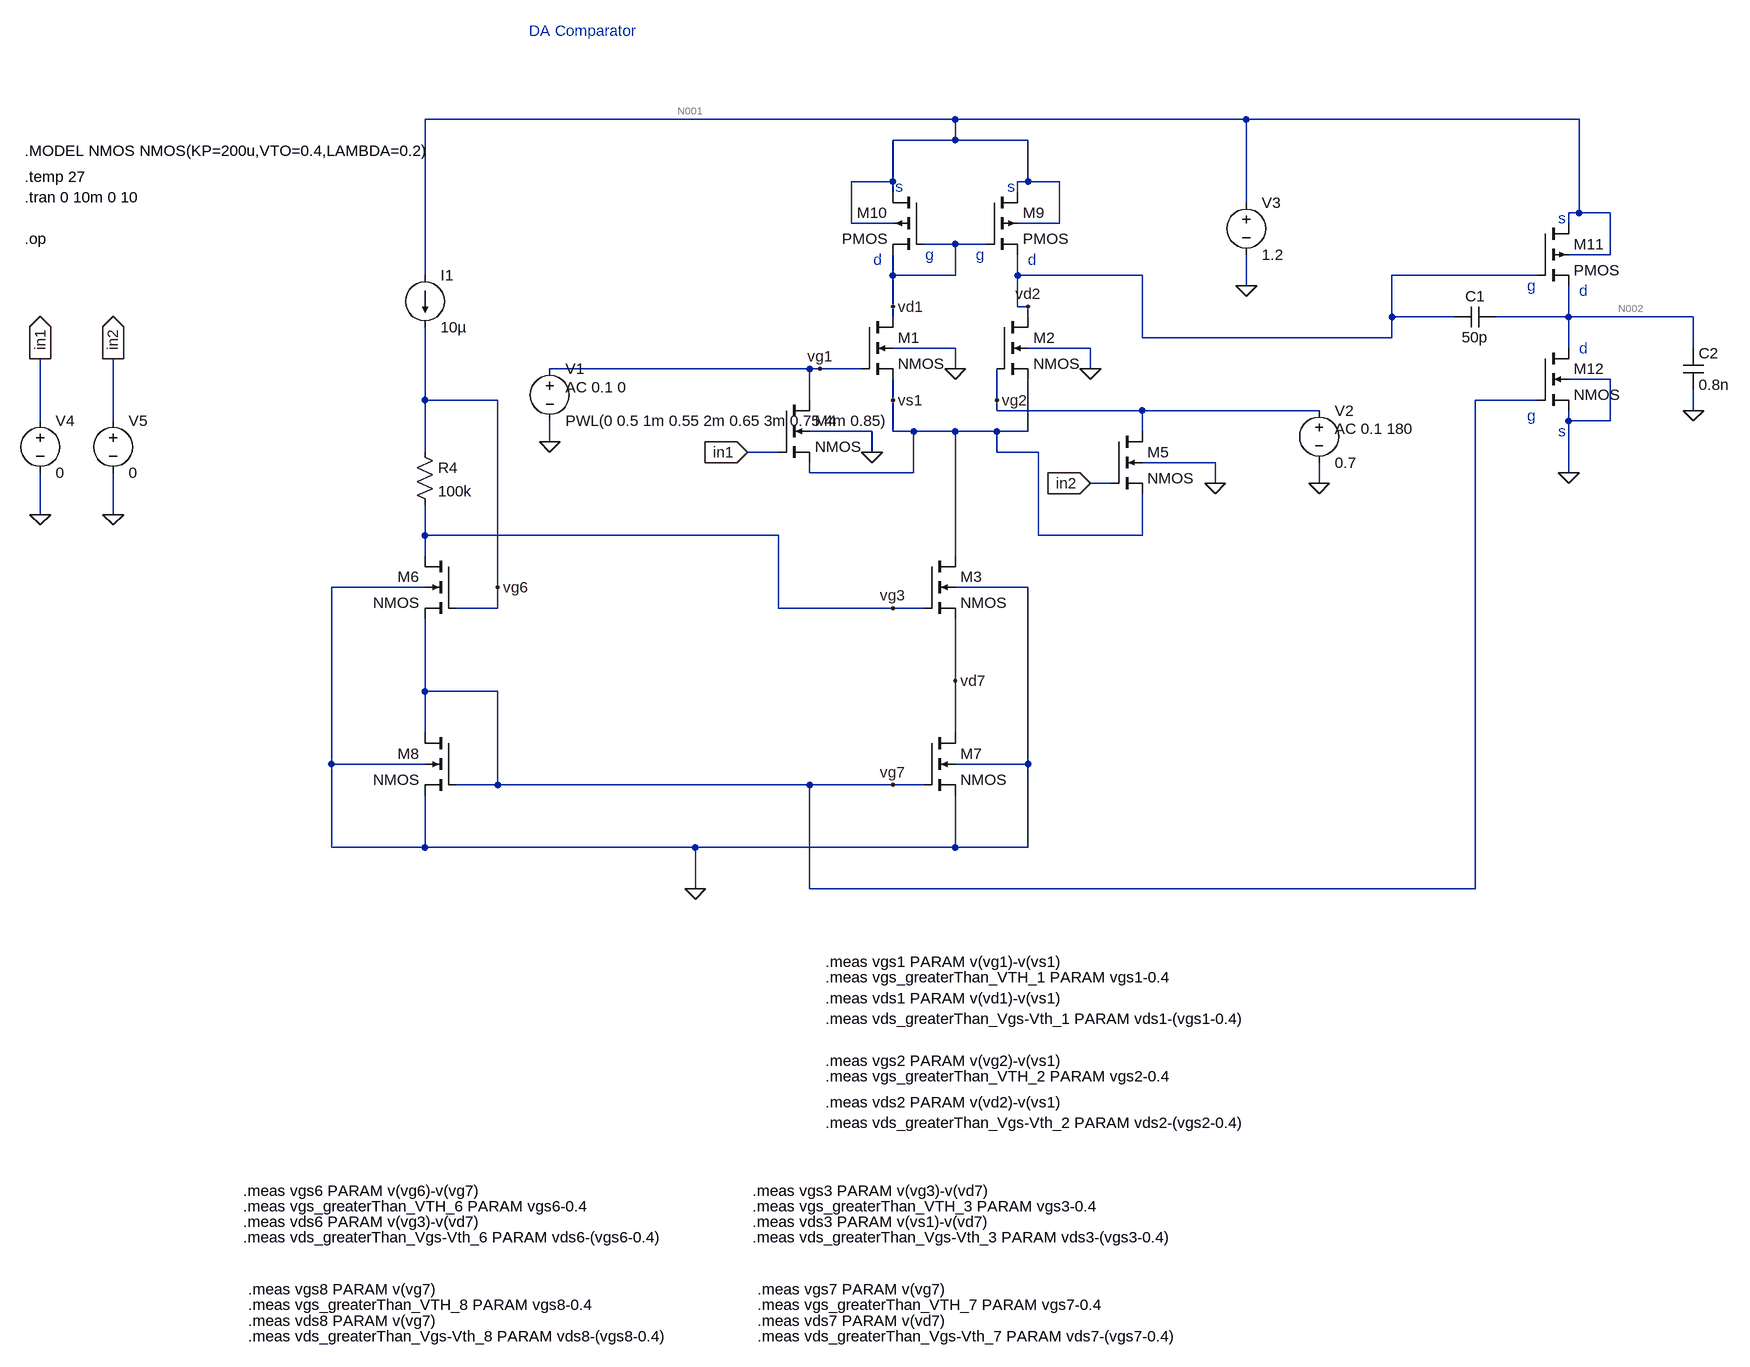
[diagram p0: schematic 10_differential_amplifier_v8_comparator_with_offset_handling.asc]
10_differential_amplifier_v8_comparator_with_offset_handling.asc, the LTspice schematic file:
Version 4
SHEET 1 2132 1296
WIRE 0 -1168 -816 -1168
WIRE 448 -1168 0 -1168
WIRE 960 -1168 448 -1168
WIRE 0 -1136 0 -1168
WIRE 0 -1136 -96 -1136
WIRE 112 -1136 0 -1136
WIRE -96 -1072 -96 -1136
WIRE -96 -1072 -160 -1072
WIRE 112 -1072 112 -1136
WIRE 112 -1072 96 -1072
WIRE 160 -1072 112 -1072
WIRE -96 -1056 -96 -1072
WIRE 96 -1056 96 -1072
WIRE 448 -1040 448 -1168
WIRE 960 -1024 960 -1168
WIRE 960 -1024 944 -1024
WIRE 1008 -1024 960 -1024
WIRE -160 -1008 -160 -1072
WIRE -96 -1008 -160 -1008
WIRE 160 -1008 160 -1072
WIRE 160 -1008 96 -1008
WIRE 944 -1008 944 -1024
WIRE 0 -976 -48 -976
WIRE 48 -976 0 -976
WIRE 1008 -960 1008 -1024
WIRE 1008 -960 944 -960
WIRE -816 -928 -816 -1168
WIRE -96 -928 -96 -960
WIRE 0 -928 0 -976
WIRE 0 -928 -96 -928
WIRE 96 -928 96 -960
WIRE 288 -928 96 -928
WIRE 896 -928 672 -928
WIRE 448 -912 448 -960
WIRE -96 -880 -96 -928
WIRE 96 -880 96 -928
WIRE 112 -880 96 -880
WIRE -96 -864 -96 -880
WIRE 112 -864 112 -880
WIRE 672 -864 672 -928
WIRE 768 -864 672 -864
WIRE 944 -864 944 -912
WIRE 944 -864 832 -864
WIRE 1136 -864 944 -864
WIRE 288 -832 288 -928
WIRE 672 -832 672 -864
WIRE 672 -832 288 -832
WIRE 0 -816 -96 -816
WIRE 208 -816 112 -816
WIRE 944 -816 944 -864
WIRE 1136 -816 1136 -864
WIRE -224 -784 -624 -784
WIRE -208 -784 -224 -784
WIRE -144 -784 -208 -784
WIRE 0 -784 0 -816
WIRE 208 -784 208 -816
WIRE 1008 -768 944 -768
WIRE -816 -736 -816 -848
WIRE -704 -736 -816 -736
WIRE -224 -736 -224 -784
WIRE -96 -736 -96 -768
WIRE 64 -736 64 -784
WIRE 896 -736 800 -736
WIRE 64 -720 64 -736
WIRE 288 -720 64 -720
WIRE 560 -720 288 -720
WIRE 1136 -720 1136 -752
WIRE -1408 -704 -1408 -800
WIRE -1296 -704 -1296 -800
WIRE 944 -704 944 -720
WIRE 1008 -704 1008 -768
WIRE 1008 -704 944 -704
WIRE -128 -688 -224 -688
WIRE -96 -688 -96 -736
WIRE -64 -688 -96 -688
WIRE 0 -688 -64 -688
WIRE 64 -688 0 -688
WIRE 112 -688 112 -768
WIRE 112 -688 64 -688
WIRE 288 -688 288 -720
WIRE -624 -672 -624 -704
WIRE -816 -656 -816 -736
WIRE -272 -656 -320 -656
WIRE -128 -656 -128 -688
WIRE 64 -656 64 -688
WIRE 128 -656 64 -656
WIRE 400 -640 288 -640
WIRE -224 -624 -224 -640
WIRE -64 -624 -64 -688
WIRE -64 -624 -224 -624
WIRE 944 -624 944 -704
WIRE 240 -608 208 -608
WIRE 400 -608 400 -640
WIRE 560 -608 560 -640
WIRE -1408 -560 -1408 -624
WIRE -1296 -560 -1296 -624
WIRE -816 -528 -816 -576
WIRE -272 -528 -816 -528
WIRE 128 -528 128 -656
WIRE 288 -528 288 -592
WIRE 288 -528 128 -528
WIRE -816 -496 -816 -528
WIRE 0 -496 0 -688
WIRE -816 -448 -960 -448
WIRE -704 -448 -704 -736
WIRE 112 -448 0 -448
WIRE -704 -416 -704 -448
WIRE -704 -416 -768 -416
WIRE -272 -416 -272 -528
WIRE -96 -416 -272 -416
WIRE -48 -416 -96 -416
WIRE 0 -304 0 -400
WIRE -816 -288 -816 -400
WIRE -704 -288 -816 -288
WIRE -816 -224 -816 -288
WIRE 0 -224 0 -304
WIRE -960 -176 -960 -448
WIRE -816 -176 -960 -176
WIRE 112 -176 112 -448
WIRE 112 -176 0 -176
WIRE -704 -144 -704 -288
WIRE -704 -144 -768 -144
WIRE -224 -144 -704 -144
WIRE -96 -144 -224 -144
WIRE -48 -144 -96 -144
WIRE -960 -48 -960 -176
WIRE -816 -48 -816 -128
WIRE -816 -48 -960 -48
WIRE -400 -48 -816 -48
WIRE 0 -48 0 -128
WIRE 0 -48 -400 -48
WIRE 112 -48 112 -176
WIRE 112 -48 0 -48
WIRE -400 16 -400 -48
WIRE -224 16 -224 -144
WIRE 800 16 800 -736
WIRE 800 16 -224 16
FLAG -624 -672 0
FLAG 0 -784 0
FLAG 208 -784 0
FLAG 560 -608 0
FLAG 448 -912 0
FLAG -208 -784 vg1
FLAG -96 -736 vs1
FLAG -96 -880 vd1
FLAG 64 -736 vg2
FLAG 112 -880 vd2
FLAG -96 -416 vg3
FLAG -1408 -560 0
FLAG -1296 -560 0
FLAG -1408 -800 in1
IOPIN -1408 -800 Out
FLAG -1296 -800 in2
IOPIN -1296 -800 Out
FLAG 400 -608 0
FLAG -128 -656 0
FLAG -320 -656 in1
IOPIN -320 -656 In
FLAG 208 -608 in2
IOPIN 208 -608 In
FLAG -400 16 0
FLAG -96 -144 vg7
FLAG 0 -304 vd7
FLAG -704 -448 vg6
FLAG 944 -624 0
FLAG 1136 -720 0
DATAFLAG 0 -304 ""
DATAFLAG 0 -608 ""
DATAFLAG -224 -144 ""
DATAFLAG -336 -784 ""
DATAFLAG 944 -864 ""
DATAFLAG 240 -928 ""
DATAFLAG 800 -432 ""
SYMBOL nmos4 -144 -864 R0
SYMATTR InstName M1
SYMATTR Value2 l=2u w=150u
SYMBOL nmos4 64 -864 R0
SYMATTR InstName M2
SYMATTR Value2 l=4u w=150u
SYMBOL nmos4 -48 -496 R0
SYMATTR InstName M3
SYMATTR Value2 l=1u w=40u
SYMBOL voltage -624 -800 R0
WINDOW 123 24 44 Left 2
WINDOW 39 0 0 Left 0
SYMATTR Value2 AC 0.1 0
SYMATTR InstName V1
SYMATTR Value PWL(0 0.5 1m 0.55 2m 0.65 3m 0.75 4m 0.85)
SYMBOL voltage 560 -736 R0
WINDOW 123 24 44 Left 2
WINDOW 39 0 0 Left 0
SYMATTR Value2 AC 0.1 180
SYMATTR InstName V2
SYMATTR Value 0.7
SYMBOL voltage 448 -1056 R0
WINDOW 123 0 0 Left 0
WINDOW 39 0 0 Left 0
SYMATTR InstName V3
SYMATTR Value 1.2
SYMBOL voltage -1408 -720 R0
WINDOW 123 0 0 Left 0
WINDOW 39 0 0 Left 0
SYMATTR InstName V4
SYMATTR Value 0
SYMBOL voltage -1296 -720 R0
WINDOW 123 0 0 Left 0
WINDOW 39 0 0 Left 0
SYMATTR InstName V5
SYMATTR Value 0
SYMBOL nmos4 -272 -736 R0
SYMATTR InstName M4
SYMATTR Value2 l=1u w=100u
SYMBOL nmos4 240 -688 R0
SYMATTR InstName M5
SYMATTR Value2 l=1u w=100u
SYMBOL current -816 -928 R0
WINDOW 123 0 0 Left 0
WINDOW 39 0 0 Left 0
SYMATTR InstName I1
SYMATTR Value 10µ
SYMBOL nmos4 -768 -496 M0
SYMATTR InstName M6
SYMATTR Value2 l=1u w=40u
SYMBOL nmos4 -48 -224 R0
SYMATTR InstName M7
SYMATTR Value2 l=1u w=60u
SYMBOL nmos4 -768 -224 M0
SYMATTR InstName M8
SYMATTR Value2 l=1u w=60u
SYMBOL res -832 -672 R0
SYMATTR InstName R4
SYMATTR Value 100k
SYMBOL pmos4 48 -1056 R0
SYMATTR InstName M9
SYMATTR Value2 l=1u w=100u
SYMBOL pmos4 -48 -1056 M0
SYMATTR InstName M10
SYMATTR Value2 l=1u w=100u
SYMBOL pmos4 896 -1008 R0
SYMATTR InstName M11
SYMATTR Value2 l=1u w=20u
SYMBOL nmos4 896 -816 R0
SYMATTR InstName M12
SYMATTR Value2 l=1u w=150u
SYMBOL cap 832 -880 R90
WINDOW 0 0 32 VBottom 2
WINDOW 3 32 32 VTop 2
SYMATTR InstName C1
SYMATTR Value 50p
SYMBOL cap 1120 -816 R0
SYMATTR InstName C2
SYMATTR Value 0.8n
TEXT -656 -1304 Left 2 ;DA Comparator
TEXT -1432 -1120 Left 2 !.MODEL NMOS NMOS(KP=200u,VTO=0.4,LAMBDA=0.2)
TEXT -1432 -1048 Left 2 !.tran 0 10m 0 10
TEXT -1432 -984 Left 2 !.op
TEXT -1432 -1080 Left 2 !.temp 27
TEXT -200 128 Left 2 !.meas vgs1 PARAM v(vg1)-v(vs1)
TEXT -200 184 Left 2 !.meas vds1 PARAM v(vd1)-v(vs1)
TEXT -200 152 Left 2 !.meas vgs_greaterThan_VTH_1 PARAM vgs1-0.4
TEXT -200 216 Left 2 !.meas vds_greaterThan_Vgs-Vth_1 PARAM vds1-(vgs1-0.4)
TEXT -200 280 Left 2 !.meas vgs2 PARAM v(vg2)-v(vs1)
TEXT -200 344 Left 2 !.meas vds2 PARAM v(vd2)-v(vs1)
TEXT -200 304 Left 2 !.meas vgs_greaterThan_VTH_2 PARAM vgs2-0.4
TEXT -200 376 Left 2 !.meas vds_greaterThan_Vgs-Vth_2 PARAM vds2-(vgs2-0.4)
TEXT -312 480 Left 2 !.meas vgs3 PARAM v(vg3)-v(vd7)
TEXT -312 528 Left 2 !.meas vds3 PARAM v(vs1)-v(vd7)
TEXT -312 504 Left 2 !.meas vgs_greaterThan_VTH_3 PARAM vgs3-0.4
TEXT -312 552 Left 2 !.meas vds_greaterThan_Vgs-Vth_3 PARAM vds3-(vgs3-0.4)
TEXT -1096 480 Left 2 !.meas vgs6 PARAM v(vg6)-v(vg7)
TEXT -1096 528 Left 2 !.meas vds6 PARAM v(vg3)-v(vd7)
TEXT -1096 504 Left 2 !.meas vgs_greaterThan_VTH_6 PARAM vgs6-0.4
TEXT -1096 552 Left 2 !.meas vds_greaterThan_Vgs-Vth_6 PARAM vds6-(vgs6-0.4)
TEXT -304 632 Left 2 !.meas vgs7 PARAM v(vg7)
TEXT -304 680 Left 2 !.meas vds7 PARAM v(vd7)
TEXT -304 656 Left 2 !.meas vgs_greaterThan_VTH_7 PARAM vgs7-0.4
TEXT -304 704 Left 2 !.meas vds_greaterThan_Vgs-Vth_7 PARAM vds7-(vgs7-0.4)
TEXT -1088 632 Left 2 !.meas vgs8 PARAM v(vg7)
TEXT -1088 680 Left 2 !.meas vds8 PARAM v(vg7)
TEXT -1088 656 Left 2 !.meas vgs_greaterThan_VTH_8 PARAM vgs8-0.4
TEXT -1088 704 Left 2 !.meas vds_greaterThan_Vgs-Vth_8 PARAM vds8-(vgs8-0.4)
TEXT 80 -1064 Left 2 ;s
TEXT 32 -960 Left 2 ;g
TEXT 112 -952 Left 2 ;d
TEXT -80 -1064 Right 2 ;s
TEXT -32 -960 Right 2 ;g
TEXT -112 -952 Right 2 ;d
TEXT 928 -1016 Left 2 ;s
TEXT 880 -912 Left 2 ;g
TEXT 960 -904 Left 2 ;d
TEXT 880 -712 Left 2 ;g
TEXT 960 -816 Left 2 ;d
TEXT 928 -688 Left 2 ;s

The netlist it stands for:
* 10_differential_amplifier_v8_comparator_with_offset_handling.asc
M1 vd1 vg1 vs1 0 NMOS l=2u w=150u
M2 vd2 vg2 vs1 0 NMOS l=4u w=150u
M3 vs1 vg3 vd7 0 NMOS l=1u w=40u
V1 vg1 0 PWL(0 0.5 1m 0.55 2m 0.65 3m 0.75 4m 0.85) AC 0.1 0
V2 vg2 0 0.7 AC 0.1 180
V3 N001 0 1.2
V4 in1 0 0
V5 in2 0 0
M4 vg1 in1 vs1 0 NMOS l=1u w=100u
M5 vg2 in2 vs1 0 NMOS l=1u w=100u
I1 N001 vg6 10µ
M6 vg3 vg6 vg7 0 NMOS l=1u w=40u
M7 vd7 vg7 0 0 NMOS l=1u w=60u
M8 vg7 vg7 0 0 NMOS l=1u w=60u
R4 vg6 vg3 100k
M9 N001 vd1 vd2 N001 PMOS l=1u w=100u
M10 N001 vd1 vd1 N001 PMOS l=1u w=100u
M11 N001 vd2 N002 N001 PMOS l=1u w=20u
M12 N002 vg7 0 0 NMOS l=1u w=150u
C1 N002 vd2 50p
C2 N002 0 0.8n
.model NMOS NMOS
.model PMOS PMOS
.lib standard.mos
* DA Comparator
.MODEL NMOS NMOS(KP=200u,VTO=0.4,LAMBDA=0.2)
.tran 0 10m 0 10
.op
.temp 27
.meas vgs1 PARAM v(vg1)-v(vs1)
.meas vds1 PARAM v(vd1)-v(vs1)
.meas vgs_greaterThan_VTH_1 PARAM vgs1-0.4
.meas vds_greaterThan_Vgs-Vth_1 PARAM vds1-(vgs1-0.4)
.meas vgs2 PARAM v(vg2)-v(vs1)
.meas vds2 PARAM v(vd2)-v(vs1)
.meas vgs_greaterThan_VTH_2 PARAM vgs2-0.4
.meas vds_greaterThan_Vgs-Vth_2 PARAM vds2-(vgs2-0.4)
.meas vgs3 PARAM v(vg3)-v(vd7)
.meas vds3 PARAM v(vs1)-v(vd7)
.meas vgs_greaterThan_VTH_3 PARAM vgs3-0.4
.meas vds_greaterThan_Vgs-Vth_3 PARAM vds3-(vgs3-0.4)
.meas vgs6 PARAM v(vg6)-v(vg7)
.meas vds6 PARAM v(vg3)-v(vd7)
.meas vgs_greaterThan_VTH_6 PARAM vgs6-0.4
.meas vds_greaterThan_Vgs-Vth_6 PARAM vds6-(vgs6-0.4)
.meas vgs7 PARAM v(vg7)
.meas vds7 PARAM v(vd7)
.meas vgs_greaterThan_VTH_7 PARAM vgs7-0.4
.meas vds_greaterThan_Vgs-Vth_7 PARAM vds7-(vgs7-0.4)
.meas vgs8 PARAM v(vg7)
.meas vds8 PARAM v(vg7)
.meas vgs_greaterThan_VTH_8 PARAM vgs8-0.4
.meas vds_greaterThan_Vgs-Vth_8 PARAM vds8-(vgs8-0.4)
* s
* g
* d
* s
* g
* d
* s
* g
* d
* g
* d
* s
.backanno
.end

* Results of the author's LTspice run, read from the files saved beside the schematic
* Operating Point, zero values left out:
*   V(vd1) = 1.155 V
*   V(vg1) = 500 mV
*   V(vs1) = 85.14 mV
*   V(vd2) = 86.39 mV
*   V(vg2) = 700 mV
*   V(vg3) = 441.2 mV
*   V(vd7) = 9.757 mV
*   V(n001) = 1.2 V
*   V(vg6) = 1.441 V
*   V(vg7) = 439.1 mV
*   V(n002) = 1.135 V
*   Id(M11) = 28.2 µA
*   Is(M11) = -28.2 µA
*   Id(M10) = 2.01 µA
*   Is(M10) = -2.01 µA
*   Id(M9) = 2.01 µA
*   Ib(M9) = 1.124 pA
*   Is(M9) = -2.01 µA
*   Id(M12) = 28.2 µA
*   Ib(M12) = -1.145 pA
*   Is(M12) = -28.2 µA
*   Id(M8) = 10 µA
*   Is(M8) = -10 µA
*   Id(M7) = 4.02 µA
*   Is(M7) = -4.02 µA
*   Id(M6) = 10 µA
*   Is(M6) = -10 µA
*   Id(M5) = 1.325 pA
*   Id(M3) = 4.02 µA
*   Is(M3) = -4.02 µA
*   Id(M2) = 2.01 µA
*   Is(M2) = -2.01 µA
*   Id(M1) = 2.01 µA
*   Ib(M1) = -1.26 pA
*   Is(M1) = -2.01 µA
*   I(I1) = 10 µA
*   I(R4) = 10 µA
*   I(V3) = -42.22 µA
*   I(V2) = -1.325 pA
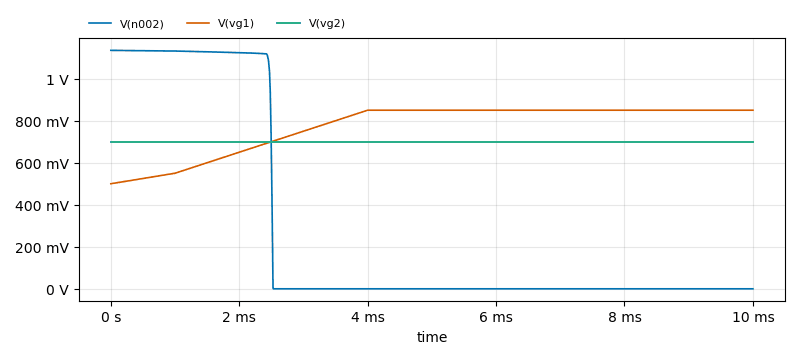
[diagram p1: Transient Analysis of 10_differential_amplifier_v8_comparator_with_offset_handling.asc, plotted from the saved traces]
* Transient Analysis, 1 run:
*   V(n002): min 0 V, max 1.135 V, average 282.2 mV, rms 563.2 mV, last 0 V
*   V(vg1): min 500 mV, max 850 mV, average 772.5 mV, rms 781.4 mV, last 850 mV
*   V(vg2): min 700 mV, max 700 mV, average 700 mV, rms 700 mV, last 700 mV
* From the log:
*   vgs1: v(vg1)-v(vs1)=0.422077
*   vds1: v(vd1)-v(vs1)=0.70748
*   vgs_greaterthan_vth_1: vgs1-0.4=0.0220771
*   vds_greaterthan_vgs-vth_1: vds1-(vgs1-0.4)=0.685403
*   vgs2: v(vg2)-v(vs1)=0.272077
*   vds2: v(vd2)-v(vs1)=0.772077
*   vgs_greaterthan_vth_2: vgs2-0.4=-0.127923
*   vds_greaterthan_vgs-vth_2: vds2-(vgs2-0.4)=0.9
*   vgs3: v(vg3)-v(vd7)=0.431028
*   vds3: v(vs1)-v(vd7)=0.41773
*   vgs_greaterthan_vth_3: vgs3-0.4=0.0310282
*   vds_greaterthan_vgs-vth_3: vds3-(vgs3-0.4)=0.386702
*   vgs6: v(vg6)-v(vg7)=1.00208
*   vds6: v(vg3)-v(vd7)=0.431028
*   vgs_greaterthan_vth_6: vgs6-0.4=0.602079
*   vds_greaterthan_vgs-vth_6: vds6-(vgs6-0.4)=-0.171051
*   vgs7: v(vg7)=0.439142
*   vds7: v(vd7)=0.0101928
*   vgs_greaterthan_vth_7: vgs7-0.4=0.0391421
*   vds_greaterthan_vgs-vth_7: vds7-(vgs7-0.4)=-0.0289493
*   vgs8: v(vg7)=0.439142
*   vds8: v(vg7)=0.439142
*   vgs_greaterthan_vth_8: vgs8-0.4=0.0391421
*   vds_greaterthan_vgs-vth_8: vds8-(vgs8-0.4)=0.4